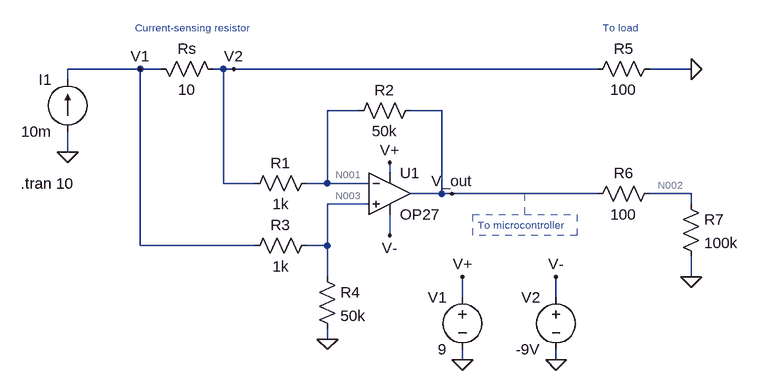
[diagram p0: schematic DC current measurement + protection.asc]
DC current measurement + protection.asc, the LTspice schematic file:
Version 4
SHEET 1 1620 792
WIRE 112 80 0 80
WIRE 144 80 112 80
WIRE 240 80 224 80
WIRE 256 80 240 80
WIRE 816 80 256 80
WIRE 960 80 896 80
WIRE 0 96 0 80
WIRE 448 144 400 144
WIRE 576 144 528 144
WIRE 0 208 0 176
WIRE 496 240 496 224
WIRE 240 256 240 80
WIRE 288 256 240 256
WIRE 400 256 400 144
WIRE 400 256 368 256
WIRE 464 256 400 256
WIRE 576 272 576 144
WIRE 576 272 528 272
WIRE 592 272 576 272
WIRE 816 272 592 272
WIRE 960 272 896 272
WIRE 464 288 400 288
WIRE 960 288 960 272
WIRE 496 336 496 304
WIRE 112 352 112 80
WIRE 288 352 112 352
WIRE 400 352 400 288
WIRE 400 352 368 352
WIRE 400 400 400 352
WIRE 960 400 960 368
WIRE 608 432 608 400
WIRE 752 432 752 400
WIRE 400 496 400 480
WIRE 608 528 608 512
WIRE 752 528 752 512
FLAG 0 208 0
FLAG 112 80 V1
FLAG 256 80 V2
FLAG 400 496 0
FLAG 960 400 0
FLAG 592 272 V_out
FLAG 752 528 0
FLAG 960 80 0
FLAG 608 528 0
FLAG 496 224 V+
FLAG 496 336 V-
FLAG 608 400 V+
FLAG 752 400 V-
SYMBOL res 128 64 M90
WINDOW 0 0 56 VBottom 2
WINDOW 3 32 56 VTop 2
SYMATTR InstName Rs
SYMATTR Value 10
SYMBOL res 384 240 R90
WINDOW 0 0 56 VBottom 2
WINDOW 3 32 56 VTop 2
SYMATTR InstName R1
SYMATTR Value 1k
SYMBOL res 544 128 R90
WINDOW 0 0 56 VBottom 2
WINDOW 3 32 56 VTop 2
SYMATTR InstName R2
SYMATTR Value 50k
SYMBOL res 384 336 R90
WINDOW 0 0 56 VBottom 2
WINDOW 3 32 56 VTop 2
SYMATTR InstName R3
SYMATTR Value 1k
SYMBOL res 384 384 R0
SYMATTR InstName R4
SYMATTR Value 50k
SYMBOL OpAmps\\OP27 496 208 R0
SYMATTR InstName U1
SYMBOL voltage 752 416 M0
WINDOW 123 0 0 Left 0
WINDOW 39 0 0 Left 0
SYMATTR InstName V2
SYMATTR Value -9V
SYMBOL current 0 176 R180
WINDOW 0 24 80 Left 2
WINDOW 3 24 0 Left 2
WINDOW 123 0 0 Left 0
WINDOW 39 0 0 Left 0
SYMATTR InstName I1
SYMATTR Value 10m
SYMBOL voltage 608 416 M0
WINDOW 123 0 0 Left 0
WINDOW 39 0 0 Left 0
SYMATTR InstName V1
SYMATTR Value 9
SYMBOL res 912 64 R90
WINDOW 0 0 56 VBottom 2
WINDOW 3 32 56 VTop 2
SYMATTR InstName R5
SYMATTR Value 100
SYMBOL res 912 256 R90
WINDOW 0 0 56 VBottom 2
WINDOW 3 32 56 VTop 2
SYMATTR InstName R6
SYMATTR Value 100
SYMBOL res 944 272 R0
SYMATTR InstName R7
SYMATTR Value 100k
TEXT -72 256 Left 2 !.tran 10
TEXT 104 16 Left 1 ;Current-sensing resistor
TEXT 632 320 Left 1 ;To microcontroller
TEXT 824 16 Left 1 ;To load
LINE Normal 704 304 704 272 2
RECTANGLE Normal 784 336 624 304 2

The netlist it stands for:
* DC current measurement + protection.asc
Rs V1 V2 10
R1 N001 V2 1k
R2 V_out N001 50k
R3 N003 V1 1k
R4 N003 0 50k
XU1 N003 N001 V+ V- V_out OP27  ; pins In+ In- V+ V- OUT
V2 V- 0 -9V
I1 0 V1 10m
V1 V+ 0 9
R5 0 V2 100
R6 N002 V_out 100
R7 N002 0 100k
.tran 10
* Current-sensing resistor
* To microcontroller
* To load
.lib ADI.lib
.backanno
.end

* Results of the author's LTspice run, read from the files saved beside the schematic
* Operating Point, zero values left out:
*   V(v1) = 1.105 V
*   V(v2) = 1.006 V
*   V(n001) = 1.084 V
*   V(v_out) = 4.989 V
*   V(n003) = 1.084 V
*   V(v+) = 9 V
*   V(v-) = -9 V
*   V(n002) = 4.984 V
*   I(I1) = 10 mA
*   I(R7) = 49.84 µA
*   I(R6) = -49.84 µA
*   I(R5) = -10.06 mA
*   I(R4) = 21.68 µA
*   I(R3) = -21.68 µA
*   I(R2) = 78.11 µA
*   I(R1) = 78.11 µA
*   I(Rs) = 9.978 mA
*   I(V1) = -2.754 mA
*   I(V2) = 2.626 mA
*   Ix(u1:1) = 181 pA
*   Ix(u1:2) = 180.3 pA
*   Ix(u1:3) = 2.754 mA
*   Ix(u1:4) = -2.626 mA
*   Ix(u1:5) = -127.9 µA